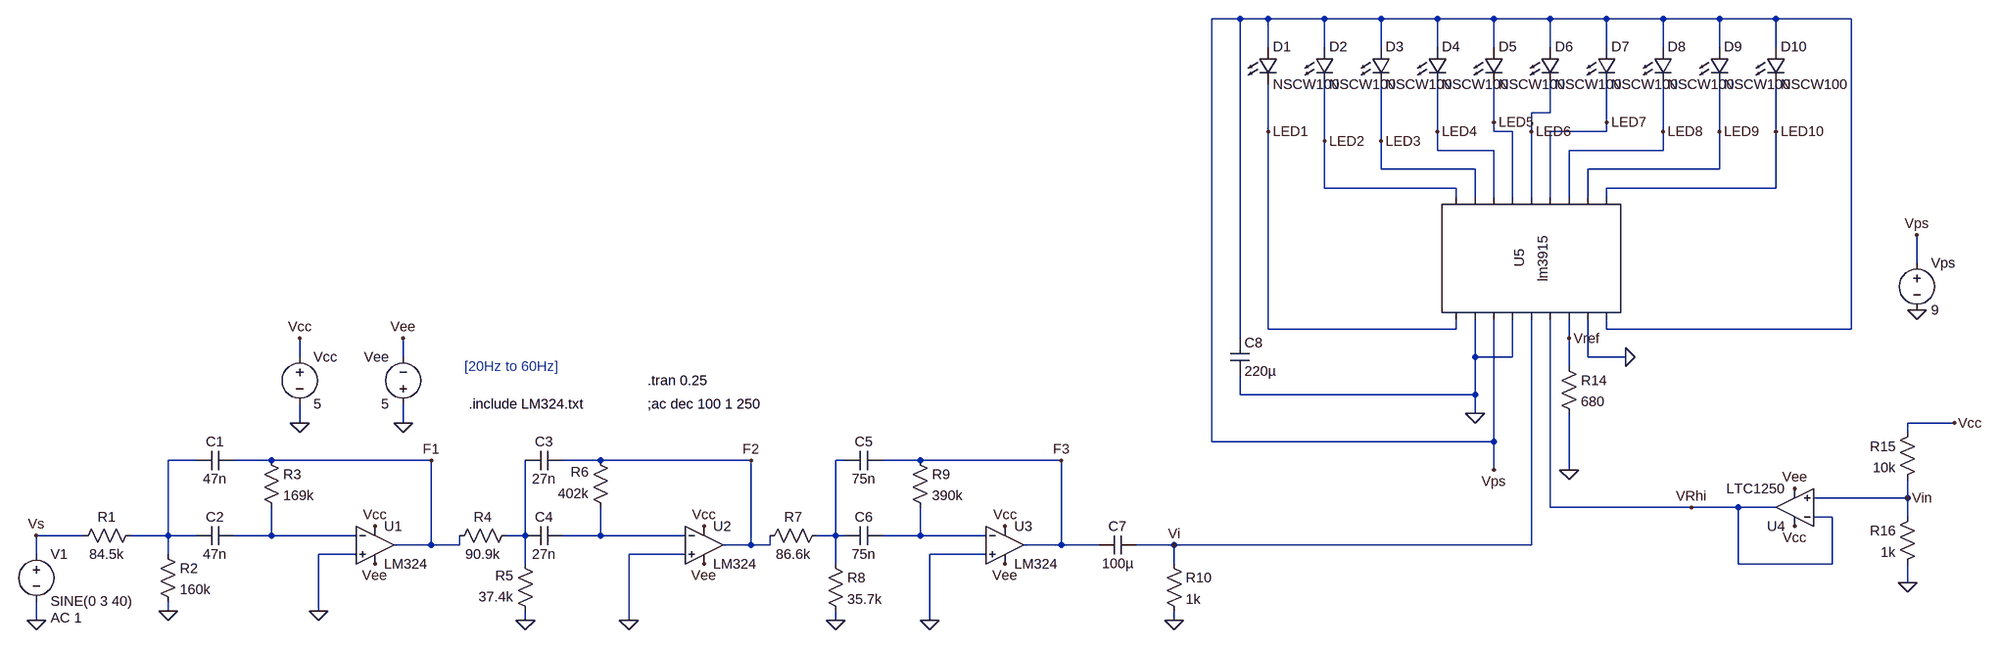
[diagram p0: schematic FinalSubBassFilterWithLEDDriver.asc]
* FinalSubBassFilterWithLEDDriver.asc
R1 N001 Vs 84.5k
V1 Vs 0 SINE(0 3 40) AC 1
R2 N001 0 160k
R3 F1 N003 169k
R4 N004 F1 90.9k
R5 0 N004 37.4k
R6 N005 F2 402k
R7 F2 N002 86.6k
R8 N002 0 35.7k
R9 F3 N006 390k
C1 F1 N001 47n
C2 N003 N001 47n
C3 F2 N004 27n
C4 N005 N004 27n
C5 F3 N002 75n
C6 N006 N002 75n
XU1 0 N003 Vcc Vee F1 LM324  ; pins In+ In- V+ V- OUT
XU2 0 N005 Vcc Vee F2 LM324  ; pins In+ In- V+ V- OUT
XU3 0 N006 Vcc Vee F3 LM324  ; pins In+ In- V+ V- OUT
Vcc Vcc 0 5
Vee 0 Vee 5
C7 Vi F3 100µ
R10 Vi 0 1k
D1 Vps LED1 NSCW100
D2 Vps LED2 NSCW100
D3 Vps LED3 NSCW100
D4 Vps LED4 NSCW100
D5 Vps LED5 NSCW100
D6 Vps LED6 NSCW100
D7 Vps LED7 NSCW100
D8 Vps LED8 NSCW100
D9 Vps LED9 NSCW100
D10 Vps LED10 NSCW100
C8 Vps 0 220µ
Vps Vps 0 9
* U5: lm3915 (symbol AutoGenerated\lm3915 not available, pins judged from their places): pin1=LED1 pin2=0 pin3=Vps pin4=0 pin5=Vi pin6=VRhi pin7=Vref pin8=0 pin9=Vps pin10=LED2 pin11=LED3 pin12=LED4 pin13=LED5 pin14=LED6 pin15=LED7 pin16=LED8 pin17=LED9 pin18=LED10
R14 Vref 0 680
R15 Vcc Vin 10k
R16 Vin 0 1k
XU4 Vin VRhi Vcc Vee VRhi LTC1250  ; pins In+ In- V+ V- OUT
.model D D
.lib standard.dio
.tran 0.25
;ac dec 100 1 250
* [20Hz to 60Hz]
.include LM324.txt
.backanno
.end

* Results of the author's LTspice run, read from the files saved beside the schematic
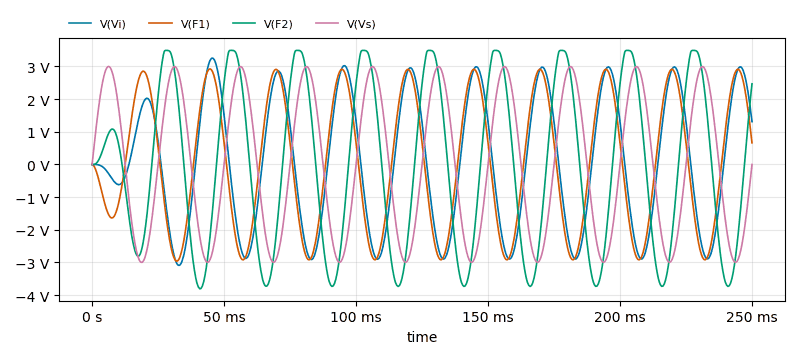
[diagram p1: Transient Analysis of FinalSubBassFilterWithLEDDriver.asc, plotted from the saved traces]
* Transient Analysis, 1 run:
*   V(Vi): min -3.091 V, max 3.259 V, average 60.39 mV, rms 2.015 V, last 1.31 V
*   V(F1): min -2.961 V, max 2.928 V, average 41.43 mV, rms 2.028 V, last 660.3 mV
*   V(F2): min -3.809 V, max 3.494 V, average -59.4 mV, rms 2.512 V, last 2.47 V
*   V(Vs): min -3 V, max 3 V, average 405.4 µV, rms 2.121 V, last 0 V